# EAGLE design piglow (EAGLE 6.4)
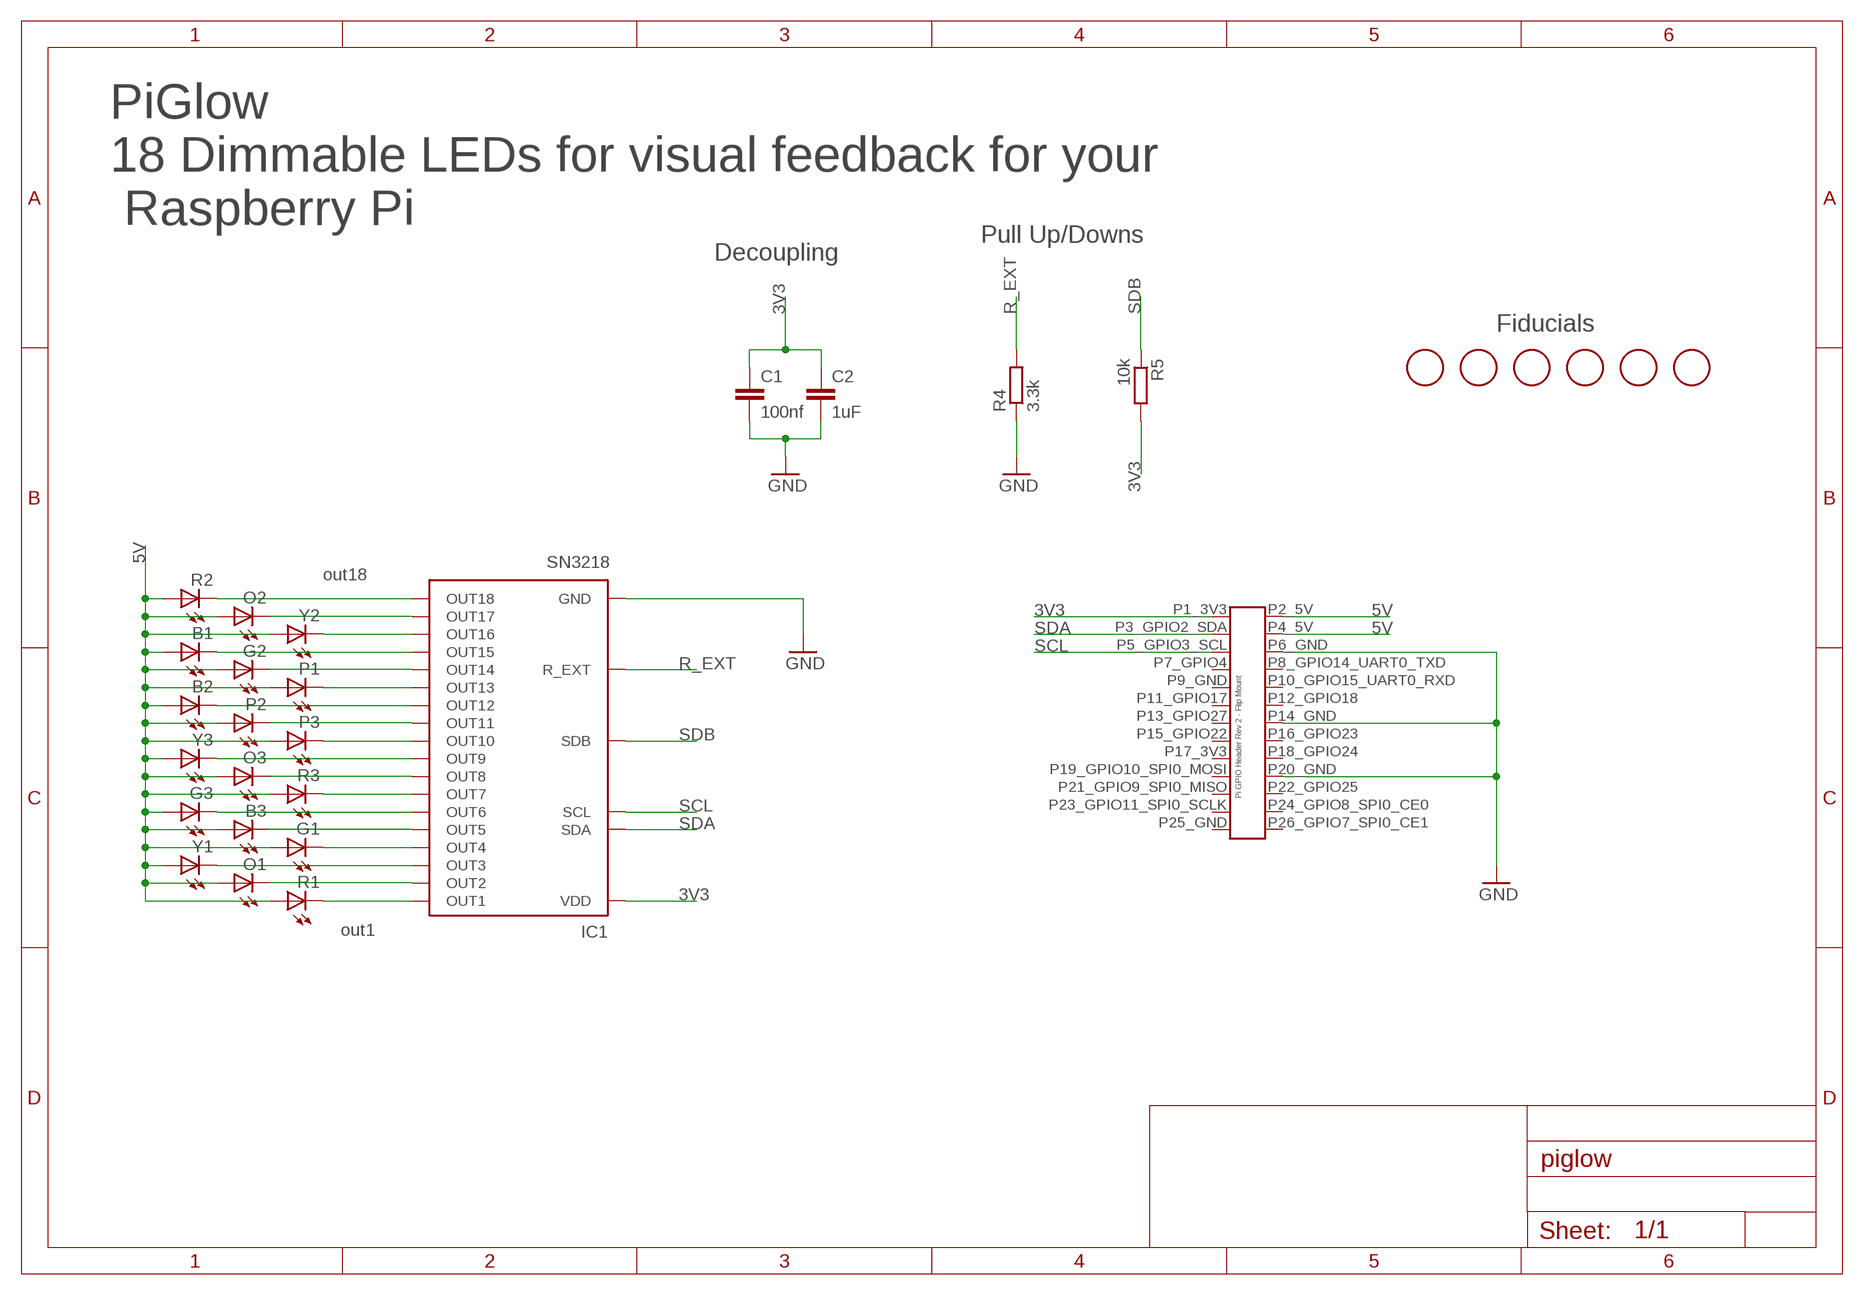
[diagram p0: schematic, sheet 1]

## Parts
B1  led-blue-0805  LEDCHIPLED_0805  [CHIPLED_0805]
B2  led-blue-0805  LEDCHIPLED_0805  [CHIPLED_0805]
B3  led-blue-0805  LEDCHIPLED_0805  [CHIPLED_0805]
C1  100nf  C-EUC0603K  [C0603K]
C2  1uF  C-EUC0603K  [C0603K]
G1  led-green-0805  LEDCHIPLED_0805  [CHIPLED_0805]
G2  led-green-0805  LEDCHIPLED_0805  [CHIPLED_0805]
G3  led-green-0805  LEDCHIPLED_0805  [CHIPLED_0805]
IC1  SN3218  [QFN24]
O1  led-orange-0805  LEDCHIPLED_0805  [CHIPLED_0805]
O2  led-orange-0805  LEDCHIPLED_0805  [CHIPLED_0805]
O3  led-orange-0805  LEDCHIPLED_0805  [CHIPLED_0805]
P1  led-pink-0805  LEDCHIPLED_0805  [CHIPLED_0805]
P2  led-pink-0805  LEDCHIPLED_0805  [CHIPLED_0805]
P3  led-pink-0805  LEDCHIPLED_0805  [CHIPLED_0805]
R1  led-red-0805  LEDCHIPLED_0805  [CHIPLED_0805]
R2  led-red-0805  LEDCHIPLED_0805  [CHIPLED_0805]
R3  led-red-0805  LEDCHIPLED_0805  [CHIPLED_0805]
R4  3.3k  R-EU_R0603  [R0603]
R5  10k  R-EU_R0603  [R0603@1]
U$1  FIDUCIAL  [FIDUCIAL_1MM]
U$2  FIDUCIAL  [FIDUCIAL_1MM]
U$3  FIDUCIAL  [FIDUCIAL_1MM]
U$4  FCI_89898_313LF_26P_CONNECTOR_SMT_FLIPPED  [FCI_89898_313LF_26P_CONNECTOR_SMT_FLIPPED]
U$5  FIDUCIAL  [FIDUCIAL_1MM]
U$6  FIDUCIAL  [FIDUCIAL_1MM]
U$7  FIDUCIAL  [FIDUCIAL_1MM]
Y1  led-yellow-0805  LEDCHIPLED_0805  [CHIPLED_0805]
Y2  led-yellow-0805  LEDCHIPLED_0805  [CHIPLED_0805]
Y3  led-yellow-0805  LEDCHIPLED_0805  [CHIPLED_0805]

## Nets
3V3: C1.1 C2.1 IC1.3(VDD) R5.2 U$4.P1_3V3
5V: B1.A B2.A B3.A G1.A G2.A G3.A O1.A O2.A O3.A P1.A P2.A P3.A R1.A R2.A R3.A U$4.P2_5V U$4.P4_5V Y1.A Y2.A Y3.A
GND: C1.2 C2.2 IC1.4(GND) IC1.GND R4.1 U$4.P6_GND U$4.P14_GND U$4.P20_GND
N$4: IC1.1(OUT18) R2.C
N$5: IC1.23(OUT17) O2.C
N$6: IC1.22(OUT16) Y2.C
N$7: B1.C IC1.21(OUT15)
N$8: IC1.7(OUT1) R1.C
N$9: IC1.8(OUT2) O1.C
N$10: IC1.9(OUT3) Y1.C
N$11: G1.C IC1.10(OUT4)
N$12: B3.C IC1.11(OUT5)
N$13: G3.C IC1.12(OUT6)
N$14: IC1.13(OUT7) R3.C
N$15: IC1.14(OUT8) O3.C
N$16: IC1.15(OUT9) Y3.C
N$17: IC1.16(OUT10) P3.C
N$18: IC1.17(OUT11) P2.C
N$20: IC1.19(OUT13) P1.C
N$21: B2.C IC1.18(OUT12)
N$22: G2.C IC1.20(OUT14)
R_EXT: IC1.2(R_EXT) R4.2
SCL: IC1.6(SCL) U$4.P5_GPIO3_SCL
SDA: IC1.5(SDA) U$4.P3_GPIO2_SDA
SDB: IC1.24(SDB) R5.1
Unconnected: U$4.P7_GPIO4 U$4.P8_GPIO14_UART0_TXD U$4.P9_GND U$4.P10_GPIO15_UART0_RXD U$4.P11_GPIO17 U$4.P12_GPIO18 U$4.P13_GPIO27 U$4.P15_GPIO22 U$4.P16_GPIO23 U$4.P18_GPIO24 U$4.P19_GPIO10_SPI0_MOSI U$4.P21_GPIO9_SPI0_MISO U$4.P22_GPIO25 U$4.P23_GPIO11_SPI0_SCLK U$4.P24_GPIO8_SPI0_CE0 U$4.P25_GND U$4.P26_GPIO7_SPI0_CE1

## Notes on the sheet
- PiGlow
  18 Dimmable LEDs for visual feedback for your
   Raspberry Pi
- Pull Up/Downs
- Decoupling
- Fiducials
- out18
- out1

## Power pins joined to a net without a drawn wire
P17_3V3: U$4.P17_3V3

## Library data of the parts
B1-B3 G1-G3 O1-O3 P1-P3 R1-R3 Y1-Y3 = adafruit:LED: LED OSRAM: - CHIPLED LG R971, LG N971, LY N971, LG Q971, LY Q971, LO R971, LY R971 LH N974, LH R974 LS Q976, LO Q976, LY Q976 LO Q996 - Hyper CHIPLED LW Q18S LB Q993, LB Q99A, LB R99A - SideLED LS A670, LO A670, LY A670, LG A670, LP A670 LB A673, LV A673, LT A673, LW A673 LH A674 LY A675 LS A676, LA A676, LO A676, LY A676, LW A676 LS A679, LY A679, LG A679 - Hyper Micro SIDELED® LS Y876, LA Y876, LO Y876, LY Y876 LT Y87S - SmartLED LW L88C, LW L88S LB L89C, LB L89S, LG L890 LS L89K, LO L89K, LY L89K LS L896, LA L896, LO L896, LY L896 - TOPLED LS T670, LO T670, LY T670, LG T670, LP T670 LSG T670, LSP T670, LSY T670, LOP T670, LYG T670 LG T671, LOG T671, LSG T671 LB T673, LV T673, LT T673, LW T673 LH T674 LS T676, LA T676, LO T676, LY T676, LB T676, LH T676, LSB T676, LW T676 LB T67C, LV T67C, LT T67C, LS T67K, LO T67K, LY T67K, LW E67C LS E67B, LA E67B, LO E67B, LY E67B, LB E67C, LV E67C, LT E67C LW T67C LS T679, LY T679, LG T679 LS T770, LO T770, LY T770, LG T770, LP T770 LB T773, LV T773, LT T773, LW T773 LH T774 LS E675, LA E675, LY E675, LS T675 LS T776, LA T776, LO T776, LY T776, LB T776 LHGB T686 LT T68C, LB T68C - Hyper Mini TOPLED® LB M676 - Mini TOPLED Santana® LG M470 LS M47K, LO M47K, LY M47K Source: http://www.osram.convergy.de/
C1 C2 = resistor:C-EU: CAPACITOR, European symbol
IC1 = pimoroni:SN3218: SN3218 16-channel LED driver
R4 = rcl:R-EU_: RESISTOR, European symbol
R5 = resistor:R-EU_: RESISTOR, European symbol
U$1-U$3 U$5-U$7 = adafruit:FIDUCIAL: For use by pick and place machines to calibrate the vision/machine, 1mm By microbuilder.eu
U$4 = pimoroni:FCI_89898_313LF_26P_CONNECTOR_SMT_FLIPPED

## Board
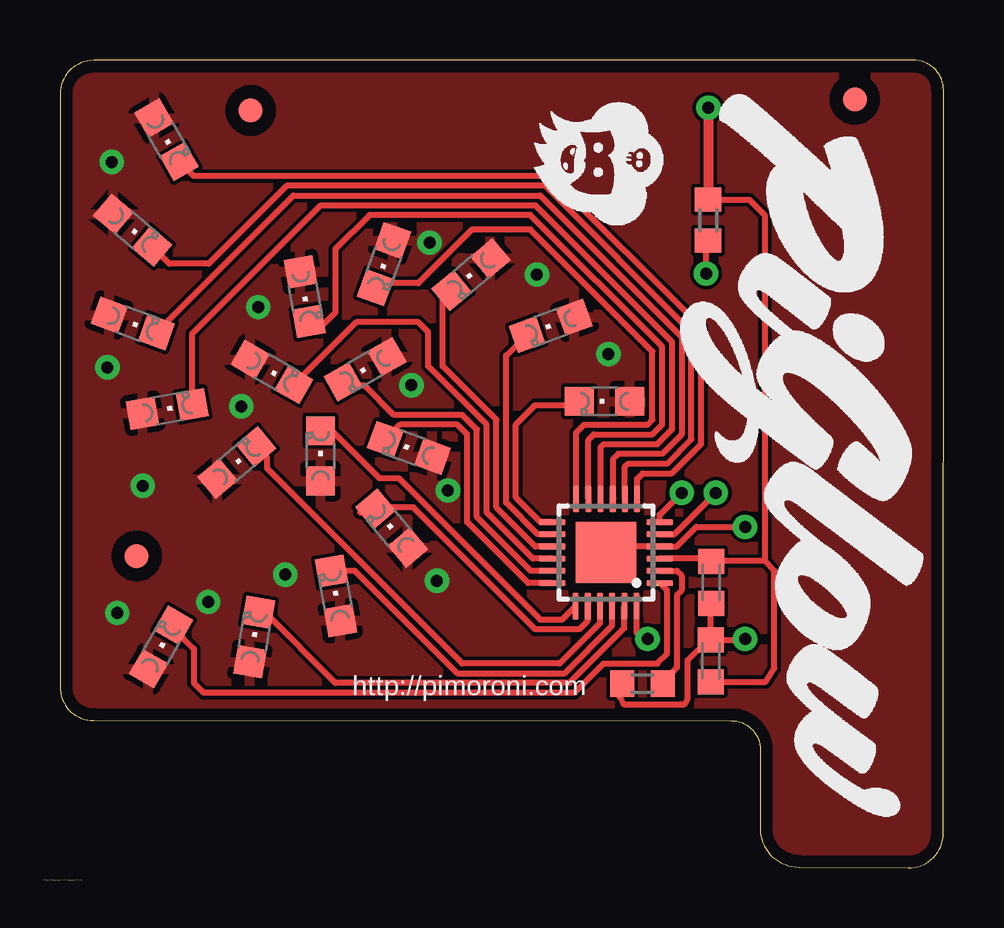
[diagram p1: board, top side]
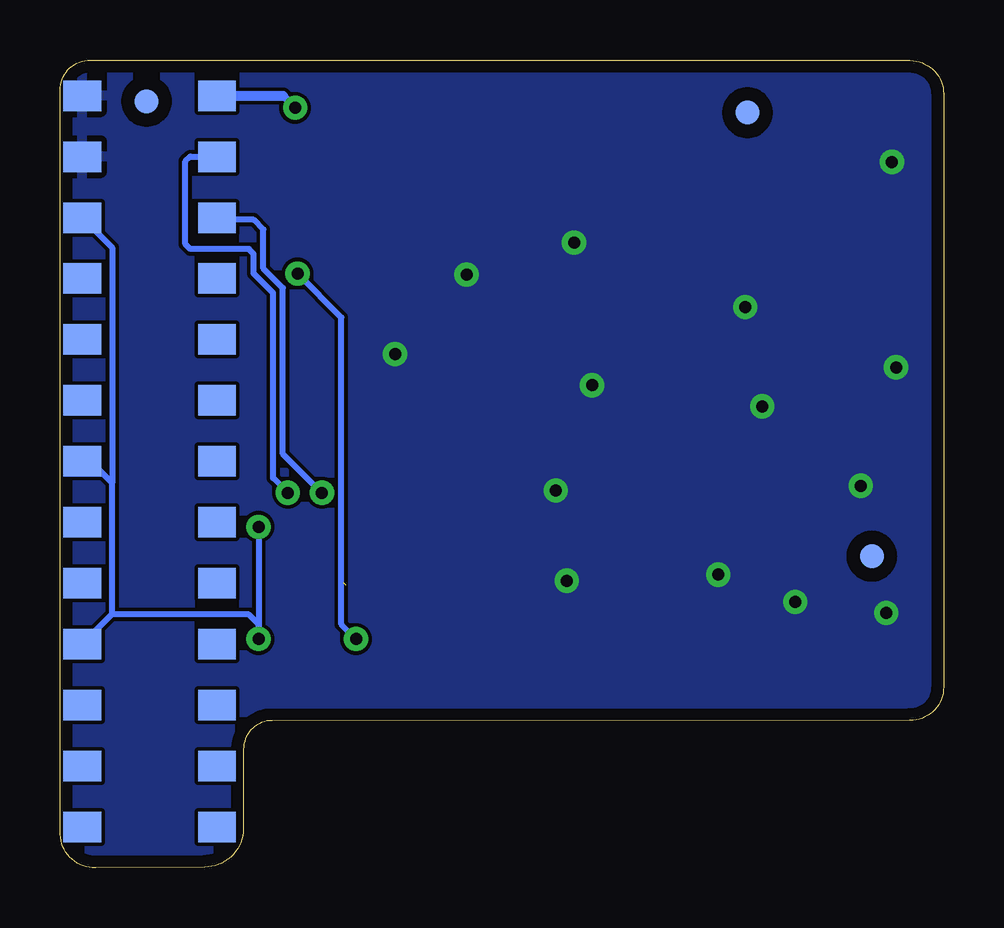
[diagram p2: board, bottom side, seen from below]

Size 36.82 x 33.68 mm. Coordinates in mm from the lower left corner, seen from the top.
Outline: 0,32.26 0,7.54 arc90 1.4,6.14 27.97,6.14 arc-90 29.17,4.94 29.17,1.63 arc90 30.79,0.03 35.33,0 arc90 36.8,1.4 36.82,32.41 arc90 35.54,33.68 1.4,33.66 arc90 0,32.26
Copper layers (1*16): Top 0.035mm / dielectric 1.5mm / Bottom 0.035mm
Design rules "pimoroni": minimum track width 8mil, minimum drill 12mil, track to track 6mil, track to pad 6mil, pad to pad 6mil, via to via 6mil, smd to smd 6mil, copper to edge 20mil, drill to drill 6mil, minimum pad ring 12mil, minimum via ring 10mil, stop-mask expansion 1mil, vias tented up to drill 25mil, thermal gap 10mil

### Footprints (pad centres in the part's own frame; a part is rotated, then mirrored left to right if it is on the bottom)
CHIPLED_0805 = smd 1.2 x 1.2: A 0,-1.05; C 0,1.05
C0603K = smd 1.05 x 1.08: 1 -0.875,0; 2 0.875,0
QFN24 = smd 1.108 x 0.254: 1 -2.235,1.27; 2 -2.235,0.762; 3 -2.235,0.254; 4 -2.235,-0.254; 5 -2.235,-0.762; 6 -2.235,-1.27; 13 2.235,-1.27; 14 2.235,-0.762; 15 2.235,-0.254; 16 2.235,0.254; 17 2.235,0.762; 18 2.235,1.27 | smd 0.254 x 1.108: 7 -1.295,-2.235; 8 -0.787,-2.235; 9 -0.279,-2.235; 10 0.229,-2.235; 11 0.737,-2.235; 12 1.245,-2.235; 19 1.27,2.235; 20 0.762,2.235; 21 0.254,2.235; 22 -0.254,2.235; 23 -0.762,2.235; 24 -1.27,2.235 | smd 2.54 x 2.54: GND 0,0
R0603 = smd 1 x 1.1: 1 -0.85,0; 2 0.85,0
FIDUCIAL_1MM = smd 1 x 1: 1 0,0
FCI_89898_313LF_26P_CONNECTOR_SMT_FLIPPED = smd 1.27 x 1.57: P1_3V3 15.24,-2.81; P2_5V 15.24,2.81; P3_GPIO2_SDA 12.7,-2.81; P4_5V 12.7,2.81; P5_GPIO3_SCL 10.16,-2.81; P6_GND 10.16,2.81; P7_GPIO4 7.62,-2.81; P8_GPIO14_UART0_TXD 7.62,2.81; P9_GND 5.08,-2.81; P10_GPIO15_UART0_RXD 5.08,2.81; P11_GPIO17 2.54,-2.81; P12_GPIO18 2.54,2.81; P13_GPIO27 0,-2.81; P14_GND 0,2.81; P15_GPIO22 -2.54,-2.81; P16_GPIO23 -2.54,2.81; P17_3V3 -5.08,-2.81; P18_GPIO24 -5.08,2.81; P19_GPIO10_SPI0_MOSI -7.62,-2.81; P20_GND -7.62,2.81; P21_GPIO9_SPI0_MISO -10.16,-2.81; P22_GPIO25 -10.16,2.81; P23_GPIO11_SPI0_SCLK -12.7,-2.81; P24_GPIO8_SPI0_CE0 -12.7,2.81; P25_GND -15.24,-2.81; P26_GPIO7_SPI0_CE1 -15.24,2.81

### Placement (x,y rotation side)
B1  7.36,16.89 310 top
B2  14.53,17.51 70 top
B3  10.2,23.82 190 top
C1  27.11,8.63 90 top
C2  27.13,11.9 270 top
G1  4.48,19.13 280 top
G2  13.82,14.16 40 top
G3  13.5,25.17 160 top
IC1  22.75,13.14 180 top
O1  3.02,26.59 230 top
O2  8.09,9.63 350 top
O3  20.44,22.59 110 top
P1  10.86,17.17 0 top
P2  12.71,20.79 120 top
P3  8.83,20.67 240 top
R1  4.44,30.35 210 top
R2  4.21,9.2 330 top
R3  22.69,19.45 90 top
R4  24.27,7.68 0 top
R5  10k  [R0603]  27.01,27 90 top
U$1  3.2,13 0 top
U$2  33.21,31.96 0 bottom
U$3  7.95,31.57 0 top
U$4  33.08,16.95 90 bottom
U$5  8.17,31.48 0 bottom
U$6  2.99,12.99 0 bottom
U$7  33.12,32.04 0 top
Y1  3.03,22.69 250 top
Y2  11.5,11.34 10 top
Y3  17.13,24.74 130 top

### Tracks (layer width: path | path; a pad name or v marks a point on that pad's centre or on a via)
3V3  (via drill 0.5)
  Top 0.254: C1.1 29.4,7.75 29.76,8.32 29.76,12.38 29.36,12.79 | 29.36,12.79 26.94,12.79 C2.1 26.82,12.89 IC1.3 | 27.02,27.86 R5.2 28.72,27.85 29.36,27.22 29.36,12.79
  Top 0.406: v27.02,31.69 27.02,27.86
  Bottom 0.305: 27.52,32.18 v27.02,31.69
  Bottom 0.406: 27.52,32.18 U$4.P1_3V3 30.32,32.37
5V  (via drill 0.5)
  other vias: 22.85,21.42 8.26,23.38 1.98,20.86 2.39,10.62 3.45,15.93 9.39,12.22 16.16,15.73 19.87,24.73 15.4,26.07 14.65,20.12 2.15,29.43 15.71,11.97 7.55,19.24 6.18,11.09
  pour Top: 0.2,33.62 0.17,6.23 28.79,5.9 29.16,0.29 36.98,0.2 36.9,33.79
  pour Bottom: 0.17,33.48 0.22,6.28 28.8,6.01 29.18,0.37 37.03,0.12 36.87,33.78 0.63,33.56
GND  (via drill 0.5)
  Top 0.254: IC1.GND 23,13.4 IC1.4 25.7,13.4 26.51,14.21 v28.54,14.21 | C1.2 27.11,11.03 C2.2 | C1.2 28.54,9.5 v28.54,9.54 | R4.1 23.32,7.71 23.32,7.12 23.49,6.82 25.85,6.82 26.03,6.82 26.16,7.02 26.16,8.65 27.08,9.54 C1.2
  Bottom 0.254: 34.66,10.55 28.95,10.55 28.54,10.15 v28.54,9.54 v28.54,14.21 | 34.66,10.55 U$4.P20_GND | 34.66,10.55 34.64,10.57 34.64,16.04 | 34.64,16.04 35.54,16.94 U$4.P14_GND | U$4.P6_GND 34.64,25.86 34.64,16.04
N$4  (1 unrouted)
  Top 0.254: R2.C 4.74,9.98 5.58,9.13 5.58,7.71 5.99,7.3 21.43,7.3 22.65,8.52 24.89,8.52 25.29,8.93 25.29,11.57 IC1.1
N$5
  Top 0.254: O2.C 8.52,10.66 11.47,7.71 21.23,7.71 23.51,10 IC1.23
N$6
  Top 0.254: Y2.C 12.29,12.38 16.55,8.12 21.02,8.12 23.01,10.1 IC1.22
N$7
  Top 0.254: B1.C 8.63,17.1 8.63,16.65 16.76,8.52 20.82,8.52 22.5,10.2 IC1.21
N$8
  Top 0.254: IC1.7 24.05,16.22 24.28,16.45 25.5,16.45 26.71,17.67 26.71,22.54 20.42,28.84 5.57,28.84 R1.C
N$9
  Top 0.254: IC1.8 23.54,16.72 23.67,16.85 25.29,16.85 26.31,17.87 26.31,22.34 20.21,28.44 9.44,28.44 6.19,25.18 4.56,25.18 O1.C
N$10
  Top 0.254: IC1.9 23.06,15.41 23.06,17.06 23.26,17.26 25.09,17.26 25.9,18.07 25.9,22.14 20.01,28.03 9.72,28.03 Y1.C
N$11
  Top 0.254: IC1.10 22.52,17.54 22.65,17.67 24.89,17.67 25.5,18.28 25.5,21.93 19.81,27.62 10.86,27.62 5.51,22.27 G1.C
  Top 0.305: G1.C
N$12
  Top 0.254: IC1.11 22.01,17.84 22.24,18.07 24.68,18.07 25.09,18.48 25.09,21.73 19.6,27.22 12.9,27.22 11.47,25.79 11.47,23.15 10.86,22.54 10.62,22.54 B3.C
N$13
  Top 0.254: IC1.12 21.51,18.15 21.84,18.48 24.48,18.48 24.68,18.68 24.68,21.53 19.6,26.61 17.16,26.61 14.93,24.37 13.33,24.37 G3.C
N$14
  Top 0.254: IC1.13 20.01,14.41 18.99,15.43 18.99,18.48 19.81,19.29 21.48,19.29 R3.C
N$15
  Top 0.254: IC1.14 19.91,13.91 18.59,15.23 18.59,21.36 O3.C
N$16
  Top 0.254: IC1.15 19.81,13.4 18.18,15.02 18.18,18.68 15.94,20.92 15.94,23.69 Y3.C
N$17
  Top 0.254: IC1.16 19.71,12.89 17.77,14.82 17.77,18.48 15.34,20.92 15.34,22.34 14.93,22.75 12.34,22.75 P3.C
N$18
  Top 0.254: IC1.17 19.6,12.38 17.37,14.62 17.37,18.28 16.76,18.89 13.91,18.89 12.69,20.1 11.96,20.1 P2.C
N$20
  Top 0.254: P1.C 11.32,18.22 13.3,16.24 14.12,16.24 20.01,10.35 20.92,10.35 IC1.19
N$21
  Top 0.254: IC1.18 19.5,11.87 16.96,14.42 16.96,18.07 16.55,18.48 14.16,18.48 B2.C
N$22
  Top 0.254: IC1.20 21.99,10.3 21.63,9.94 19.81,9.94 14.73,15.02 12.69,15.02 12.49,14.82 13.01,14.82 G2.C
R_EXT
  Top 0.254: IC1.2 25.7,12.38 25.9,12.18 25.9,11.57 25.7,11.37 25.7,8.36 R4.2
SCL  (via drill 0.5)
  Top 0.254: IC1.6 24.99,14.72 v25.9,15.63
  Bottom 0.254: v25.9,15.63 27.53,17.26 27.53,24.17 28.34,24.98 28.34,26.61 28.75,27.01 30.18,27.01 U$4.P5_GPIO3_SCL
SDA  (via drill 0.5)
  Top 0.254: IC1.5 25.6,13.91 v27.32,15.63
  Bottom 0.254: v27.32,15.63 27.93,16.24 27.93,23.97 28.75,24.78 28.75,25.59 28.95,25.79 31.39,25.79 31.59,26 31.59,29.45 31.39,29.66 30.28,29.66 U$4.P3_GPIO2_SDA
SDB  (via drill 0.5)
  Top 0.254: IC1.24 24.02,9.79 v24.48,9.54 | v26.92,24.78 26.92,26.06 R5.1
  Bottom 0.254: v24.48,9.54 25.09,10.15 25.09,22.95 v26.92,24.78

### Text on the board
tPlace: http://pimoroni.com | E:/Dropbox/Eagle/projects/PiGlow/piglow1200.bmp